# EAGLE design module_SX1278_type1 (EAGLE 9.4.1)
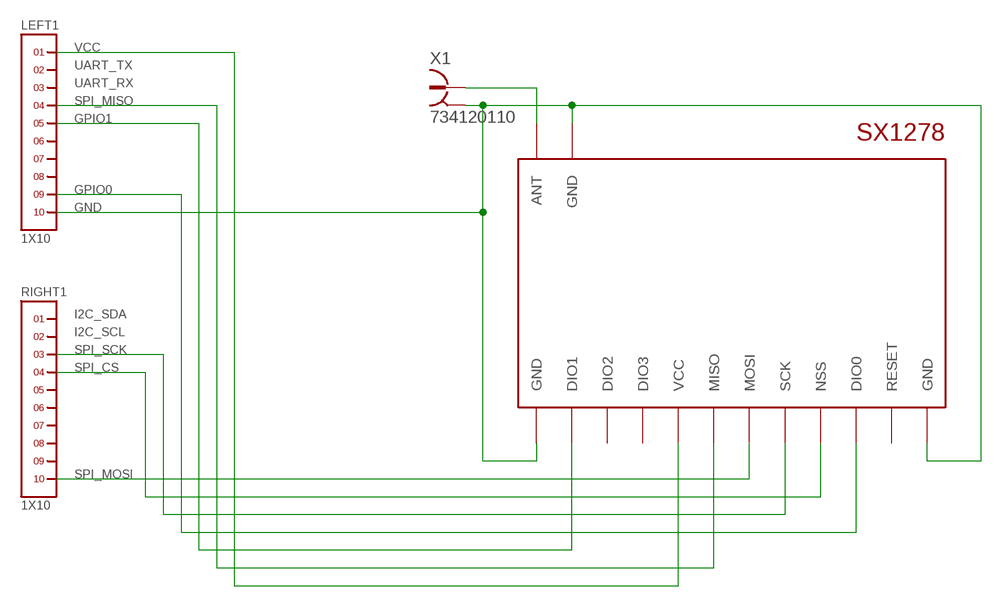
[diagram p0: schematic, sheet 1]

## Parts
LEFT1  1X10  [1X10]
RIGHT1  1X10  [1X10]
U$1  SX1278_1  [SX1278_1]
X1  734120110  [734120110]

## Nets
GND: LEFT1.10 U$1.GND@1(GND) U$1.GND@2(GND) U$1.GND@3(GND) X1.S@1 X1.S@2 X1.S@3
N$1: U$1.ANT X1.1
N$2: RIGHT1.10 U$1.MOSI
N$3: RIGHT1.4 U$1.NSS
N$4: RIGHT1.3 U$1.SCK
N$5: LEFT1.9 U$1.DIO0
N$6: LEFT1.5 U$1.DIO1
N$7: LEFT1.4 U$1.MISO
N$8: LEFT1.1 U$1.VCC
Unconnected: LEFT1.2 LEFT1.3 LEFT1.6 LEFT1.7 LEFT1.8 RIGHT1.1 RIGHT1.2 RIGHT1.5 RIGHT1.6 RIGHT1.7 RIGHT1.8 RIGHT1.9 U$1.DIO2 U$1.DIO3 U$1.RESET

## Notes on the sheet
- VCC
- UART_TX
- UART_RX
- SPI_MISO
- GPIO1
- GPIO0
- GND
- I2C_SDA
- I2C_SCL
- SPI_SCK
- SPI_CS
- SPI_MOSI

## Library data of the parts
LEFT1 RIGHT1 = headers(2mm):1X10
U$1 = RadioShield:SX1278_1
X1 = con-coax:734120110: MICRO COAXIAL CONNECTOR RECEPTACLE VERTICAL Source: Data sheet <http://www.molex.com/pdm_docs/sd/734120110_sd.pdf>

## Board
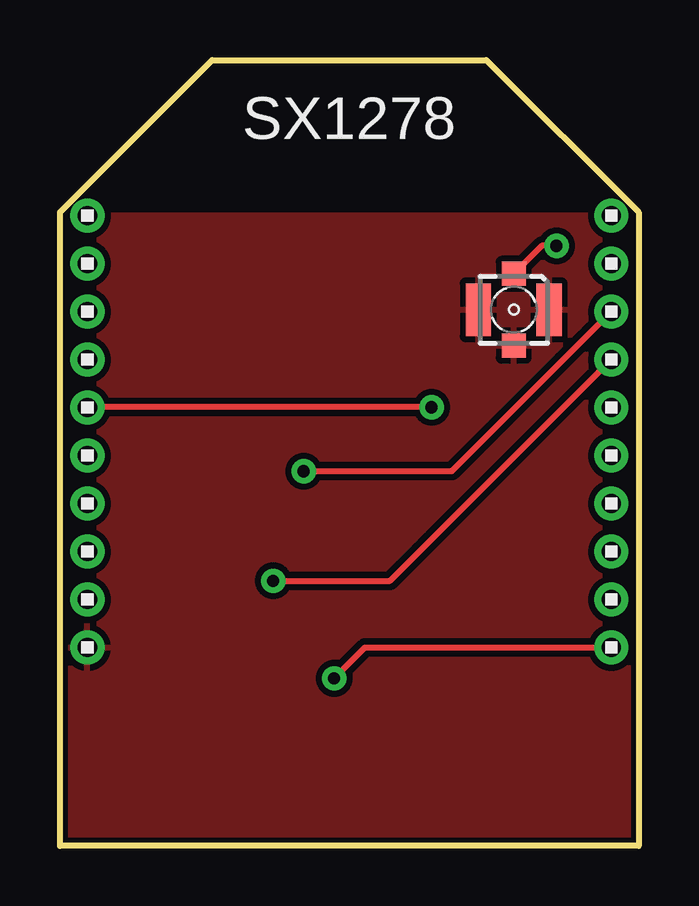
[diagram p1: board, top side]
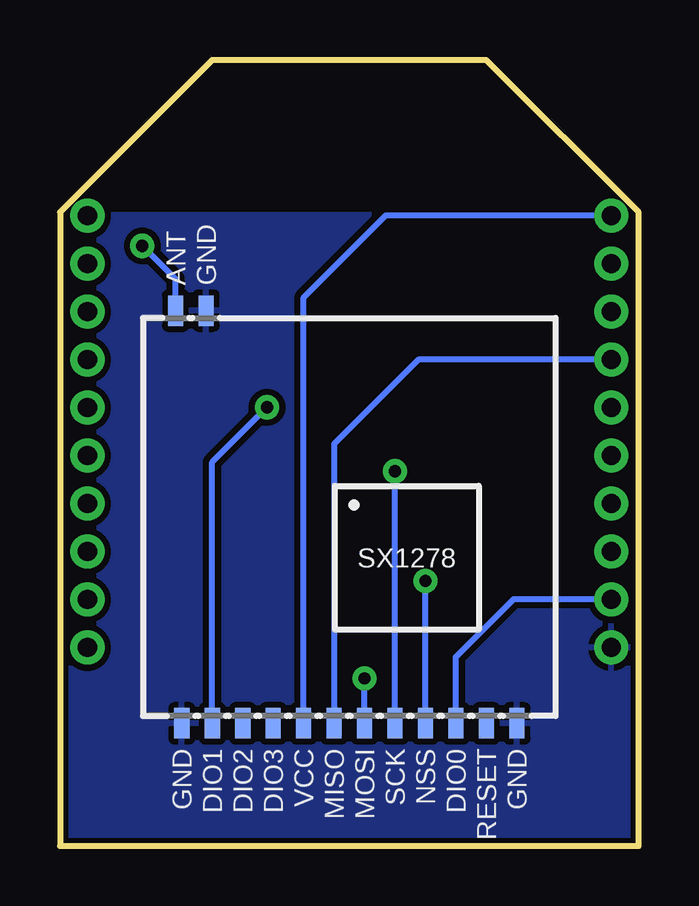
[diagram p2: board, bottom side, seen from below]

Size 24.13 x 32.77 mm. Coordinates in mm from the lower left corner, seen from the top.
Outline: 0,0 0,26.42 6.35,32.77 17.78,32.77 24.13,26.42 24.13,0 0,0
Copper layers (1*16): Top 0.035mm / dielectric 1.5mm / Bottom 0.035mm
Design rules "SparkFun-2-layer-STANDARD": minimum track width 10mil, minimum drill 20mil, track to track 10mil, track to pad 8mil, pad to pad 8mil, via to via 10mil, smd to smd 8mil, copper to edge 8mil, drill to drill 8mil, minimum pad ring 10mil, minimum via ring 10mil, stop-mask expansion 4mil, vias tented up to drill 25mil, thermal gap 10mil

### Footprints (pad centres in the part's own frame; a part is rotated, then mirrored left to right if it is on the bottom)
1X10 = drill 0.8 pad 1.422: 1 -9,0; 2 -7,0; 3 -5,0; 4 -3,0; 5 -1,0; 6 1,0; 7 3,0; 8 5,0; 9 7,0; 10 9,0
SX1278_1 = smd 0.635 x 1.27: ANT -7.239,8.6; DIO0 4.445,-8.6; DIO1 -5.715,-8.6; DIO2 -4.445,-8.6; DIO3 -3.175,-8.6; GND@1 -6.985,-8.6; GND@2 6.985,-8.6; GND@3 -5.969,8.6; MISO -0.635,-8.6; MOSI 0.635,-8.6; NSS 3.175,-8.6; RESET 5.715,-8.6; SCK 1.905,-8.6; VCC -1.905,-8.6
734120110 = smd 1 x 1: 1 0,-1.5; S@1 0,1.5 | smd 1.05 x 2.2: S@2 -1.475,0; S@3 1.475,0

### Placement (x,y rotation side)
LEFT1  1.14,17.27 270 top
RIGHT1  22.99,17.27 270 top
U$1  12.06,13.72 0 bottom
X1  18.92,22.35 180 top

### Tracks (layer width: path | path; a pad name or v marks a point on that pad's centre or on a via)
GND
  pour Bottom: -0.51,-0.51 -0.51,26.29 24.64,26.29 24.64,-0.51
  pour Top: -0.25,-0.25 -0.25,26.29 24.38,26.29 24.38,-0.25
N$1  (via drill 0.51)
  Top 0.254: v20.7,25.02 20.09,25.02 X1.1
  Bottom 0.254: U$1.ANT 19.3,23.62 v20.7,25.02
N$2  (via drill 0.51)
  Top 0.254: v11.43,6.99 12.72,8.27 RIGHT1.10
  Bottom 0.254: U$1.MOSI v11.43,6.99
N$3  (via drill 0.51)
  Top 0.254: v8.89,11.05 13.76,11.05 RIGHT1.4
  Bottom 0.254: U$1.NSS v8.89,11.05
N$4  (via drill 0.51)
  Top 0.254: v10.16,15.62 16.34,15.62 RIGHT1.3
  Bottom 0.254: U$1.SCK v10.16,15.62
N$5
  Bottom 0.254: U$1.DIO0 7.62,7.87 5.21,10.29 1.16,10.29 LEFT1.9
N$6  (via drill 0.51)
  Top 0.254: v15.49,18.29 1.16,18.29 LEFT1.5
  Bottom 0.254: U$1.DIO1 17.78,16 v15.49,18.29
N$7
  Bottom 0.254: U$1.MISO 12.7,16.76 9.19,20.27 LEFT1.4
N$8
  Bottom 0.254: U$1.VCC 13.97,22.86 10.54,26.29 1.16,26.29 LEFT1.1

### Text on the board
tNames: SX1278